# Altium project NeuroTech PCB.PrjPcb
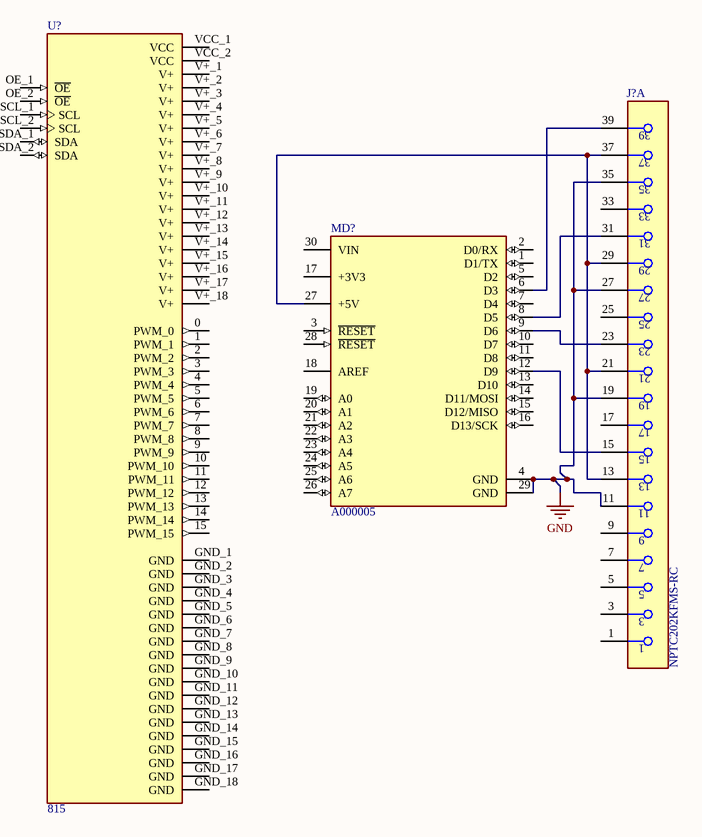
[diagram p0: Schematic.SchDoc]
1 sheet, 3 parts. Net scope: global (net labels, ports and power ports of the same name join across sheets).
Board file: Board.PcbDoc

## Sheet Schematic.SchDoc
size A; SheetNumber: 1; SheetTotal: 1

### Parts
Connector  NPTC202KFMS-RC  [FP-NPTC202KFMS-RC-MFG]  (part A of 2)
Mini  A000005  [FP-A000005-MFG]
U?  815  [MODULE_815]

### Nets
GND: Connector.11 Connector.19 Connector.27 Connector.35 Mini.4(GND) Mini.29(GND)
NetConnector_13: Connector.13 Connector.21 Connector.29 Connector.37 Mini.27(+5V)
NetConnector_15: Connector.15 Mini.12(D9)
NetConnector_23: Connector.23 Mini.9(D6)
NetConnector_31: Connector.31 Mini.8(D5)
NetConnector_39: Connector.39 Mini.6(D3)

Not connected (* = marked no-connect by the designer): Connector 1 3 5 7 9 17 25 33; Mini 1(D1/TX) 2(D0/RX) 3(~{RESET}) 5(D2) 7(D4) 10(D7) 11(D8) 13(D10) 14(D11/MOSI) 15(D12/MISO) 16(D13/SCK) 17(+3V3) 18(AREF) 19(A0) 20(A1) 21(A2) 22(A3) 23(A4) 24(A5) 25(A6) 26(A7) 28(~{RESET}) 30(VIN); U? 0(PWM_0) 1(PWM_1) 2(PWM_2) 3(PWM_3) 4(PWM_4) 5(PWM_5) 6(PWM_6) 7(PWM_7) 8(PWM_8) 9(PWM_9) 10(PWM_10) 11(PWM_11) 12(PWM_12) 13(PWM_13) 14(PWM_14) 15(PWM_15) GND_1(GND) GND_2(GND) GND_3(GND) GND_4(GND) GND_5(GND) GND_6(GND) GND_7(GND) GND_8(GND) GND_9(GND) GND_10(GND) GND_11(GND) GND_12(GND) GND_13(GND) GND_14(GND) GND_15(GND) GND_16(GND) GND_17(GND) GND_18(GND) OE_1(~{OE}) OE_2(~{OE}) SCL_1(SCL) SCL_2(SCL) SDA_1(SDA) SDA_2(SDA) V+_1(V+) V+_2(V+) V+_3(V+) V+_4(V+) V+_5(V+) V+_6(V+) V+_7(V+) V+_8(V+) V+_9(V+) V+_10(V+) V+_11(V+) V+_12(V+) V+_13(V+) V+_14(V+) V+_15(V+) V+_16(V+) V+_17(V+) V+_18(V+) VCC_1(VCC) VCC_2(VCC)

### Library data of the parts
Connector = CMP-25680-000011-1: CONN HDR 40POS 0.1 TIN SMD; Manufacturer: Sullins Connector Solutions; Pitch: 2.54mm; Conn Gender: Female; Voltage Rating: 250V; Current Rating: 3A; Number Of Contacts: 40; Is Female: yes; Conn Orientation: Straight
Mini = CMP-189986-000002-1: ARDUINO NANO ATMEGA328 EVAL BRD; Number of Bits: 8; Evaluation Kit: Yes; Operating Supply Voltage: 12V; Interface: I2C; Data Bus Width: 8b; Core Architecture: AVR
U? = 815: Adafruit 16-Channel 12-bit PWM/Servo Driver - I2C interface - PCA9685; SnapEDA_Link: https://www.snapeda.com/parts/815/Adafruit+Industries/view-part/?ref=snap; Package: Non-Standard Adafruit; Value: *; MF: Adafruit; MP: 815; Check_prices: https://www.snapeda.com/parts/815/Adafruit+Industries/view-part/?ref=eda